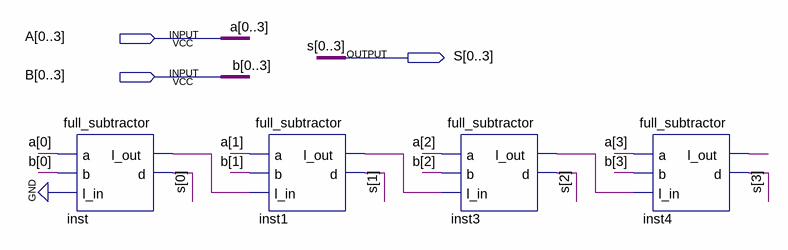
[diagram p0: schematic sheet]
// Quartus schematic subtractor_4bits.bdf as structural Verilog: 4 symbols, 3 pins
module subtractor_4bits (
  input  [0:3] A,
  input  [0:3] B,
  output [0:3] S
);

  wire inst1_l_out, inst3_l_out, inst4_l_out, inst_l_out;

  full_subtractor inst (.a(A[0]), .b(B[0]), .l_in(1'b0), .l_out(inst_l_out), .d(S[0]));
  full_subtractor inst1 (.a(A[1]), .b(B[1]), .l_in(inst_l_out), .l_out(inst1_l_out), .d(S[1]));
  full_subtractor inst3 (.a(A[2]), .b(B[2]), .l_in(inst1_l_out), .l_out(inst3_l_out), .d(S[2]));
  full_subtractor inst4 (.a(A[3]), .b(B[3]), .l_in(inst3_l_out), .l_out(inst4_l_out), .d(S[3]));
endmodule
